# EasyEDA Pro project FOC12.epro, board PCB4
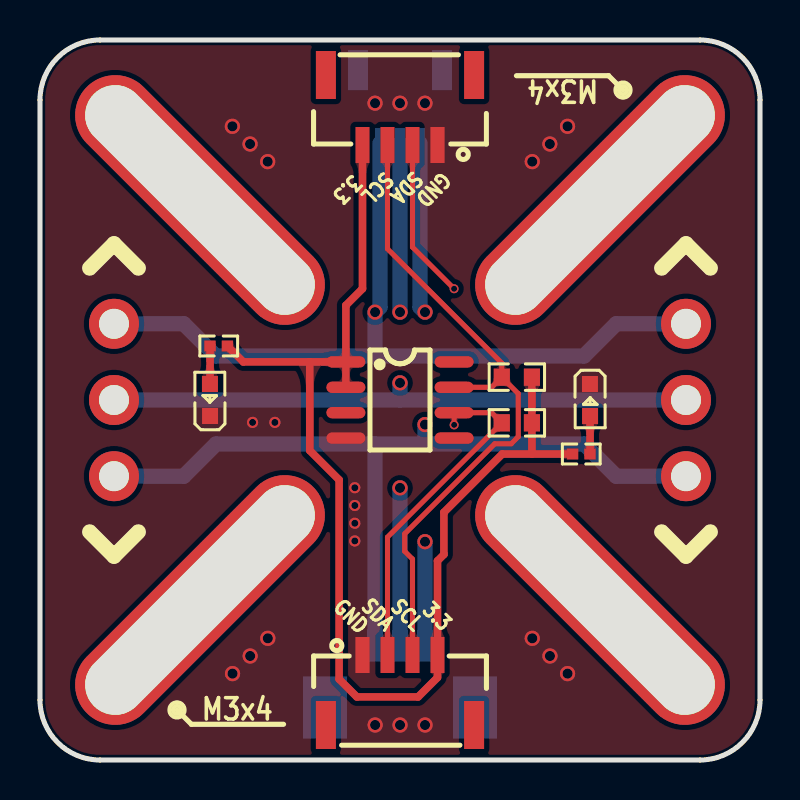
[diagram p4: board, top side]
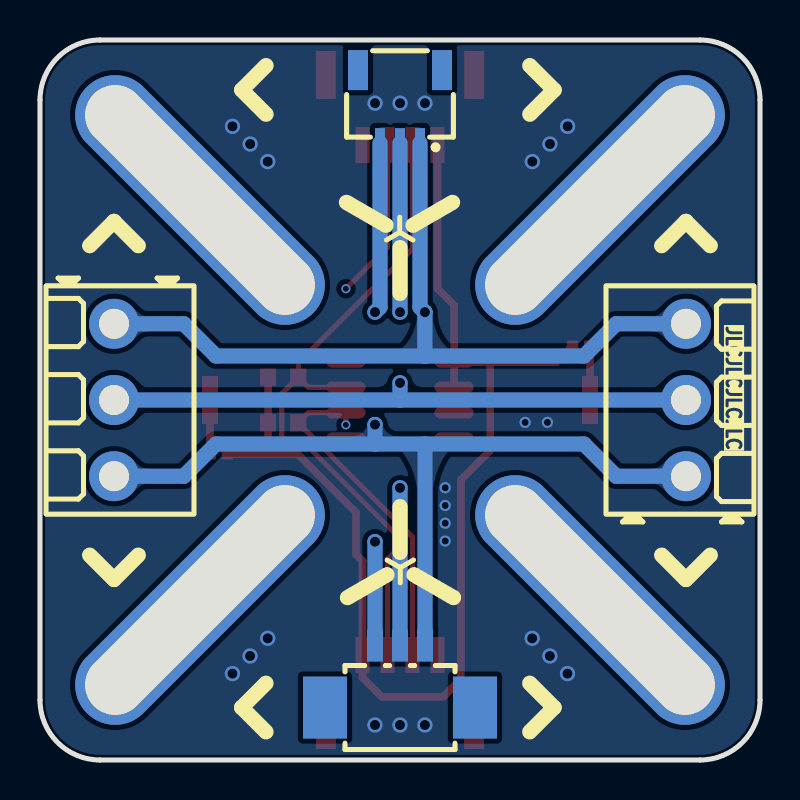
[diagram p5: board, bottom side, seen from below]

Outline 36 x 36 mm; copper layers: Top Layer, Inner1, Inner2, Bottom Layer. Coordinates in mm from the lower left corner of the outline.
Outline path: 0,33 arc(0.88,35.12) 3,36 33,36 arc(35.12,35.12) 36,33 36,3 arc(35.12,0.88) 33,0 3,0 arc(0.88,0.88) 0,3 0,33
Stack: Top Layer 0.035mm 外层铜厚1oz / Dielectric1 0.2104mm 7628 RC49% 8.6mil / Inner1 0.0152mm 内层铜厚 / Dielectric2 1.065mm 1.1mm H/HOZ Copper / Inner2 0.0152mm 内层铜厚 / Dielectric3 0.2104mm 7628 RC49% 8.6mil / Bottom Layer 0.035mm 外层铜厚1oz

## Design rules (mm)
template: 自定义配置
spacing copperThickness1oz (default): track to track 0.102, other pairs 0.152 to 0.3
spacing copperThickness2oz: track to track 0.203, other pairs 0.152 to 0.3
track width copperThickness1oz (default): min 0.127, default 0.254, max 2.54
track width copperThickness2oz: min 0.203, default 0.254, max 2.54
differential pair differentialPair (default): width min 0.127, default 0.254, max 2.54; gap min 0.152, default 0.152
via viaSize (default): diameter min 0.45, default 0.61, max 10; hole min 0.3, default 0.305, max 6.299

## Placement (name value [footprint] x y rotation side)
CN1  DB125-3.81-3P-RD-S  [CONN-TH_3P-P3.81_L7.4-W11.4]  3.7 18 90 bottom
CN2  DB125-3.81-3P-RD-S  [CONN-TH_3P-P3.81_L7.4-W11.4]  32.3 18 270 bottom
CN3  HC-GH-4PWT  [CONN-SMD_HC-GH-4PWT]  18 32.5 180 top
CN5  HC-1.0-3PWT  [CONN-SMD_3P-P1.0-HC-1.0-3PWT]  18 32.67 0 bottom
CN6  HC-GH-4PWT  [CONN-SMD_HC-GH-4PWT]  18 3.5 0 top
LED1  XL-1608UBC-04_蓝  [LED0603-RD_BLUE]  8.5 18 90 top
LED2  XL-1608UBC-04_蓝  [LED0603-RD_BLUE]  27.5 18 270 top
NOREF  -  [Pad_e22]  28 28 225 top
NOREF#2  -  [Pad_e19]  8 8 225 top
NOREF#3  -  [Pad_e20]  8 28 135 top
NOREF#4  -  [Pad_e21]  28 8 135 top
R1  10kΩ  [R0603]  23.84 19.14 0 top
R2  10kΩ  [R0603]  23.84 16.86 0 top
R3  1kΩ  [R0402]  8.94 20.7 0 top
R4  1kΩ  [R0402]  27.06 15.3 180 top
U1  AS5600-ASOT  [SOIC-8_L5.0-W4.0-P1.27-LS6.0-BL]  18 18 270 top
U2  532610371  [CONN-TH_532610371]  18 4.17 180 bottom

## Footprints (pads in the part's own frame, mm; a bottom-side part is the same pattern mirrored in y, then rotated)
CONN-SMD_3P-P1.0-HC-1.0-3PWT
  rect 0.5x1.5 smd: 1(-1,1.825) 2(0,1.825) 3(1,1.825)
  rect 1x2 smd: 4(-2.1,-1.825) 5(2.1,-1.825)
CONN-SMD_HC-GH-4PWT
  rect 0.7x1.8 smd: 1(-1.875,1.75) 2(-0.625,1.75) 3(0.625,1.75) 4(1.875,1.75)
  rect 1x2.4 smd: 5(3.705,-1.75) 6(-3.705,-1.75)
CONN-TH_3P-P3.81_L7.4-W11.4
  round 2.5 hole 1.5: 1(-3.81,0) 2(0,0) 3(3.81,0)
CONN-TH_532610371
  rect 0.8x1.6 smd: 1(-1.25,1.55) 2(0,1.55) 3(1.25,1.55)
  rect 2.2x3.1 smd: 4(3.75,-1.55) 5(-3.75,-1.55)
LED0603-RD_BLUE
  rect 0.8x0.8 smd: 1(-0.8,-0.003) 2(0.8,0.003)
Pad_e19
  oval 16x4 hole 15x3: 1(0,0)
Pad_e20
  oval 16x4 hole 15x3: 1(0,0)
Pad_e21
  oval 16x4 hole 15x3: 1(0,0)
Pad_e22
  oval 16x4 hole 15x3: 1(0,0)
R0402
  rect 0.566x0.54 smd: 1(-0.433,0) 2(0.433,0)
R0603
  rect 0.806x0.864 smd: 1(-0.753,0) 2(0.753,0)
SOIC-8_L5.0-W4.0-P1.27-LS6.0-BL
  oval 0.569x1.95 smd: 1(-1.905,-2.705) 2(-0.635,-2.705) 3(0.635,-2.705) 4(1.905,-2.705) 5(1.905,2.705) 6(0.635,2.705) 7(-0.635,2.705) 8(-1.905,2.705)

## Nets
As in the schematic.

Pads without a net: CN3 5 6; CN5 4 5; CN6 5 6; NOREF 1; NOREF#2 1; NOREF#3 1; NOREF#4 1; U1 3 5 8; U2 4 5

## Via types
v1: diameter 0.762, hole 0.508, Top Layer to Bottom Layer, 25 vias
v2: diameter 0.45, hole 0.305, Top Layer to Bottom Layer, 2 vias
v3: diameter 0.559, hole 0.355, Top Layer to Bottom Layer, 6 vias

## Routing (per net, layer and track width the routed paths; a pad name or vN(x,y) marks a point on that pad's centre or on a via; arc(x,y) is an arc through that point)
+3.3V_1: length 60.7
  Top Layer w0.381: U1.2 U1.1 ; U1.1 13.49,19.91 ; U1.1 15.29,22.73 16.12,23.56 CN3.4 ; R1.2 R2.2 24.6,15.3 ; R3.2 10.16,19.91 13.49,19.91 ; 13.49,19.91 13.49,15.47 14.95,14.01 14.95,4.04 15.84,3.15 18.9,3.15 19.88,4.12 CN6.4 19.88,9.96 20.2,10.28 20.2,12.38 23.12,15.3 24.6,15.3 ; 24.6,15.3 R4.2
DGND:
  vias: v1(9.62,31.68) v1(9.63,4.32) v1(10.5,30.8) v1(10.51,5.2) v1(11.38,29.92) v1(11.39,6.08) v1(16.75,32.84) v1(16.76,1.75) v1(18,32.84) v1(18,1.75) v1(19.25,32.84) v1(19.25,1.75) v1(24.61,29.92) v1(24.61,6.08) v1(25.49,30.8) v1(25.5,5.2) v1(26.38,31.68) v1(26.38,4.32) v3(10.63,16.88) v3(11.74,16.88) v3(15.74,13.61) v3(15.74,12.73) v3(15.74,11.84) v3(15.74,10.95)
SCL: length 33.8
  Top Layer w0.254: CN6.3 18.62,10.05 18.23,10.44 18.23,11.31 22.73,15.81 23.56,15.81 23.91,16.16 23.91,18.32 R1.1 ; U1.7 22.58,18.64 R1.1 ; R1.1 23.09,19.85 17.38,25.56 CN3.3
SDA: length 31.9
  Top Layer w0.254: 20.71,16.76 U1.6 22.58,17.36 R2.1 17.38,11.14 17.38,5.42 ; v2(20.71,23.56) 18.62,25.64 CN3.2
  Inner1 w0.254: 20.72,16.81 v2(20.71,16.76) ; 20.72,16.81 20.71,16.83 v2(20.71,23.56) ; 20.72,16.81 20.71,16.79
U: length 59
  Inner2 w0.762: v1(19.25,10.91) 18.23,10.91 16.75,12.39 v1(16.75,22.39)
  Bottom Layer w0.762: 16.76,20.2 27.2,20.2 28.81,21.81 CN2.1 ; 16.76,20.2 16.75,20.2 ; 16.76,20.2 16.75,20.2 ; 16.76,20.2 16.75,20.21 ; CN5.1 17,22.64 v1(16.75,22.39) 16.75,20.21 16.75,20.21 ; 16.75,20.21 16.75,20.2 ; 16.75,20.2 8.8,20.2 7.19,21.81 CN1.3 ; U2.1 v1(19.25,10.91)
V: length 54.6
  Inner2 w0.762: v1(18,13.61) v1(18,18.86) v1(18,22.39)
  Bottom Layer w0.762: 18,18 CN1.2 ; 18,18 v1(18,18.86) ; 18,18 CN2.2 ; CN5.2 v1(18,22.39) ; U2.2 v1(18,13.61)
W: length 55.2
  Inner2 w0.762: v1(19.25,16.77) v1(19.25,22.39)
  Bottom Layer w0.254: 16.75,15.78 16.77,15.8
  Bottom Layer w0.762: CN5.3 19,22.64 v1(19.25,22.39) ; U2.3 16.75,15.78 ; CN2.3 28.81,14.19 27.2,15.8 19.25,15.8 ; v1(19.25,16.77) 19.25,15.8 ; 19.25,15.8 8.8,15.8 7.19,14.19 CN1.1
$1N581: length 1.9
  Top Layer w0.254: 8.5,18.8 8.5,18.81
  Top Layer w0.381: 8.5,18.81 R3.1
$1N584: length 1.9
  Top Layer w0.254: 27.5,15.31 R4.1
  Top Layer w0.381: 27.5,17.2 27.5,15.31

## Copper pours and planes (outline as drawn; the poured copper is in the pictures)
DGND on Top Layer: -0.51,36.68 36.31,36.68 36.31,-0.78 -0.51,-0.78
DGND on Bottom Layer: -0.51,36.68 36.31,36.68 36.31,-0.78 -0.51,-0.78
DGND on Inner1: -0.51,36.68 36.31,36.68 36.31,-0.78 -0.51,-0.78
DGND on Inner2: -0.51,36.68 36.31,36.68 36.31,-0.78 -0.51,-0.78

Small or netless copper shapes (teardrops, artwork), in the pictures only: 29 on Top Layer, 10 on Bottom Layer, 2 on Inner1

## Text on the board
Bottom Silkscreen Layer: JLCJLCJLCJLC
Top Silkscreen Layer: GND | SDA | SCL | 3.3 | M3x4
